# EAGLE design LEDSync_AR (EAGLE 8.3.2)
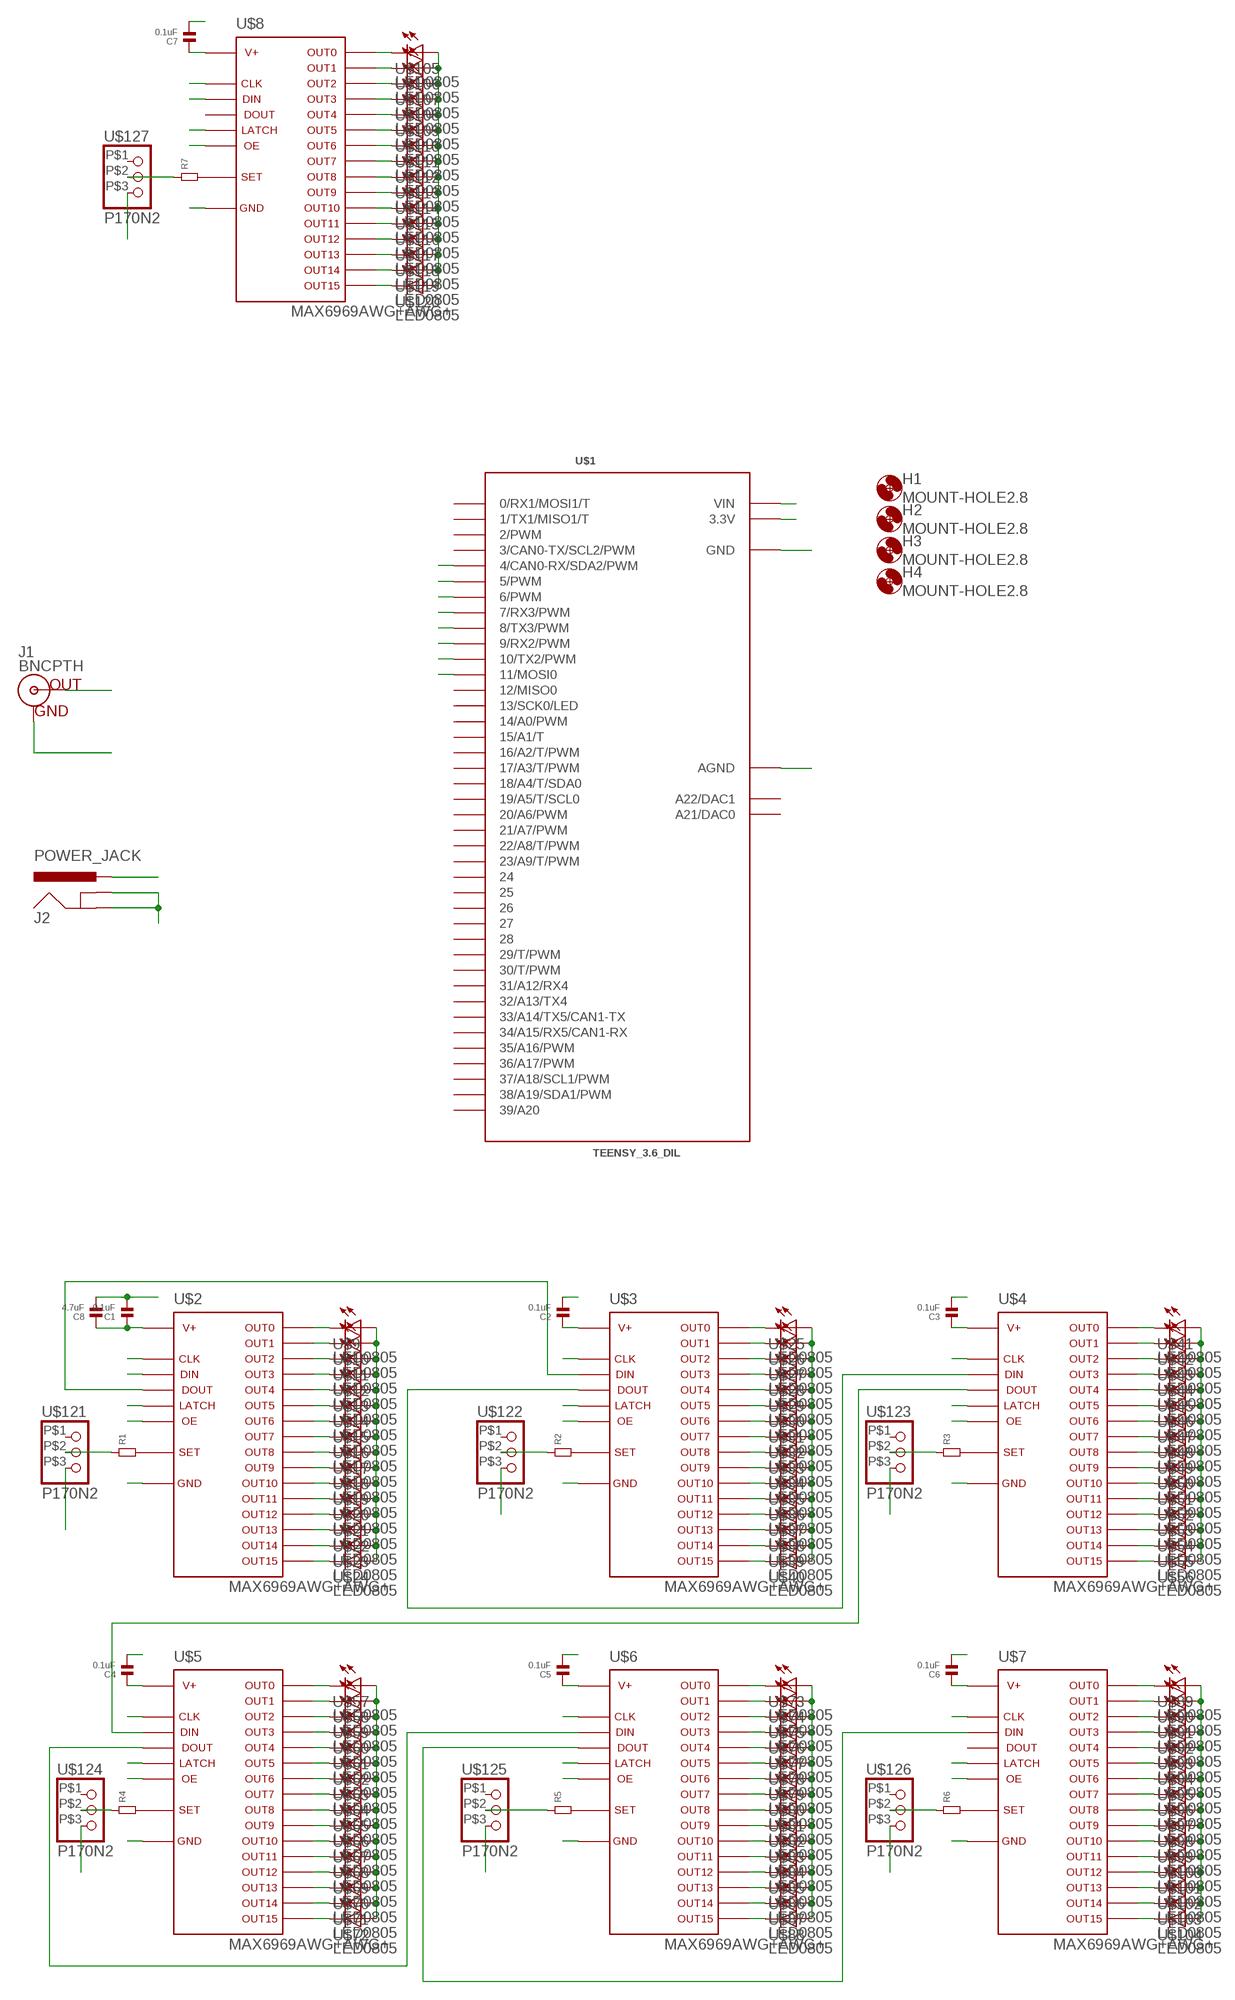
[diagram p0: schematic, sheet 1]

## Parts
C1  0.1uF  CAPACITOR.0805  [0805]
C2  0.1uF  CAPACITOR.0805  [0805]
C3  0.1uF  CAPACITOR.0805  [0805]
C4  0.1uF  CAPACITOR.0805  [0805]
C5  0.1uF  CAPACITOR.0805  [0805]
C6  0.1uF  CAPACITOR.0805  [0805]
C7  0.1uF  CAPACITOR.0805  [0805]
C8  4.7uF  CAPACITOR.0805  [0805]
H1  MOUNT-HOLE2.8  [2,8]
H2  MOUNT-HOLE2.8  [2,8]
H3  MOUNT-HOLE2.8  [2,8]
H4  MOUNT-HOLE2.8  [2,8]
J1  BNCPTH  [BNC]
J2  POWER_JACK  [POWER_JACK_PTH]
R1  RESISTOR.0805  [0805]
R2  RESISTOR.0805  [0805]
R3  RESISTOR.0805  [0805]
R4  RESISTOR.0805  [0805]
R5  RESISTOR.0805  [0805]
R6  RESISTOR.0805  [0805]
R7  RESISTOR.0805  [0805]
U$1  TEENSY_3.6_DIL  [TEENSY_3.6_DIL]
U$2  MAX6969AWG+AWG+  [SO24L]
U$3  MAX6969AWG+AWG+  [SO24L]
U$4  MAX6969AWG+AWG+  [SO24L]
U$5  MAX6969AWG+AWG+  [SO24L]
U$6  MAX6969AWG+AWG+  [SO24L]
U$7  MAX6969AWG+AWG+  [SO24L]
U$8  MAX6969AWG+AWG+  [SO24L]
U$9  LED0805  [0805]
U$10  LED0805  [0805]
U$11  LED0805  [0805]
U$12  LED0805  [0805]
U$13  LED0805  [0805]
U$14  LED0805  [0805]
U$15  LED0805  [0805]
U$16  LED0805  [0805]
U$17  LED0805  [0805]
U$18  LED0805  [0805]
U$19  LED0805  [0805]
U$20  LED0805  [0805]
U$21  LED0805  [0805]
U$22  LED0805  [0805]
U$23  LED0805  [0805]
U$24  LED0805  [0805]
U$25  LED0805  [0805]
U$26  LED0805  [0805]
U$27  LED0805  [0805]
U$28  LED0805  [0805]
U$29  LED0805  [0805]
U$30  LED0805  [0805]
U$31  LED0805  [0805]
U$32  LED0805  [0805]
U$33  LED0805  [0805]
U$34  LED0805  [0805]
U$35  LED0805  [0805]
U$36  LED0805  [0805]
U$37  LED0805  [0805]
U$38  LED0805  [0805]
U$39  LED0805  [0805]
U$40  LED0805  [0805]
U$41  LED0805  [0805]
U$42  LED0805  [0805]
U$43  LED0805  [0805]
U$44  LED0805  [0805]
U$45  LED0805  [0805]
U$46  LED0805  [0805]
U$47  LED0805  [0805]
U$48  LED0805  [0805]
U$49  LED0805  [0805]
U$50  LED0805  [0805]
U$51  LED0805  [0805]
U$52  LED0805  [0805]
U$53  LED0805  [0805]
U$54  LED0805  [0805]
U$55  LED0805  [0805]
U$56  LED0805  [0805]
U$57  LED0805  [0805]
U$58  LED0805  [0805]
U$59  LED0805  [0805]
U$60  LED0805  [0805]
U$61  LED0805  [0805]
U$62  LED0805  [0805]
U$63  LED0805  [0805]
U$64  LED0805  [0805]
U$65  LED0805  [0805]
U$66  LED0805  [0805]
U$67  LED0805  [0805]
U$68  LED0805  [0805]
U$69  LED0805  [0805]
U$70  LED0805  [0805]
U$71  LED0805  [0805]
U$72  LED0805  [0805]
U$73  LED0805  [0805]
U$74  LED0805  [0805]
U$75  LED0805  [0805]
U$76  LED0805  [0805]
U$77  LED0805  [0805]
U$78  LED0805  [0805]
U$79  LED0805  [0805]
U$80  LED0805  [0805]
U$81  LED0805  [0805]
U$82  LED0805  [0805]
U$83  LED0805  [0805]
U$84  LED0805  [0805]
U$85  LED0805  [0805]
U$86  LED0805  [0805]
U$87  LED0805  [0805]
U$88  LED0805  [0805]
U$89  LED0805  [0805]
U$90  LED0805  [0805]
U$91  LED0805  [0805]
U$92  LED0805  [0805]
U$93  LED0805  [0805]
U$94  LED0805  [0805]
U$95  LED0805  [0805]
U$96  LED0805  [0805]
U$97  LED0805  [0805]
U$98  LED0805  [0805]
U$99  LED0805  [0805]
U$100  LED0805  [0805]
U$101  LED0805  [0805]
U$102  LED0805  [0805]
U$103  LED0805  [0805]
U$104  LED0805  [0805]
U$105  LED0805  [0805]
U$106  LED0805  [0805]
U$107  LED0805  [0805]
U$108  LED0805  [0805]
U$109  LED0805  [0805]
U$110  LED0805  [0805]
U$111  LED0805  [0805]
U$112  LED0805  [0805]
U$113  LED0805  [0805]
U$114  LED0805  [0805]
U$115  LED0805  [0805]
U$116  LED0805  [0805]
U$117  LED0805  [0805]
U$118  LED0805  [0805]
U$119  LED0805  [0805]
U$120  LED0805  [0805]
U$121  P170N2  [P170N2]
U$122  P170N2  [P170N2]
U$123  P170N2  [P170N2]
U$124  P170N2  [P170N2]
U$125  P170N2  [P170N2]
U$126  P170N2  [P170N2]
U$127  P170N2  [P170N2]

## Nets
3V3: U$1.3.3V U$1.3.3V3(3.3V)
G_CLK: U$1.5(5/PWM) U$2.3 U$3.3 U$4.3 U$5.3 U$6.3 U$7.3
G_D: U$1.4(4/CAN0-RX/SDA2/PWM) U$2.2
G_LE: J1.S(OUT) U$1.6(6/PWM) U$2.4 U$3.4 U$4.4 U$5.4 U$6.4 U$7.4
G_OE: U$1.7(7/RX3/PWM) U$2.21 U$3.21 U$4.21 U$5.21 U$6.21 U$7.21
GND: C1.2 C2.2 C3.2 C4.2 C5.2 C6.2 C7.2 C8.2 J1.GND J2.GND J2.GNDBREAK U$1.AGND U$1.GND U$1.GND1(GND) U$2.1 U$3.1 U$4.1 U$5.1 U$6.1 U$7.1 U$8.1 U$121.P$3 U$122.P$3 U$123.P$3 U$124.P$3 U$125.P$3 U$126.P$3 U$127.P$3
N$1: U$2.5 U$9.2(C)
N$2: U$2.6 U$10.2(C)
N$3: U$2.7 U$11.2(C)
N$4: U$2.8 U$12.2(C)
N$5: U$2.9 U$13.2(C)
N$6: U$2.10 U$14.2(C)
N$7: U$2.11 U$15.2(C)
N$8: U$2.12 U$16.2(C)
N$9: U$2.13 U$17.2(C)
N$10: U$2.14 U$18.2(C)
N$11: U$2.15 U$19.2(C)
N$12: U$2.16 U$20.2(C)
N$13: U$2.17 U$21.2(C)
N$14: U$2.18 U$22.2(C)
N$15: U$2.19 U$23.2(C)
N$16: U$2.20 U$24.2(C)
N$17: U$3.5 U$25.2(C)
N$18: U$3.6 U$26.2(C)
N$19: U$3.7 U$27.2(C)
N$20: U$3.8 U$28.2(C)
N$21: U$3.9 U$29.2(C)
N$22: U$3.10 U$30.2(C)
N$23: U$3.11 U$31.2(C)
N$24: U$3.12 U$32.2(C)
N$25: U$3.13 U$33.2(C)
N$26: U$3.14 U$34.2(C)
N$27: U$3.15 U$35.2(C)
N$28: U$3.16 U$36.2(C)
N$29: U$3.17 U$37.2(C)
N$30: U$3.18 U$38.2(C)
N$31: U$3.19 U$39.2(C)
N$32: U$3.20 U$40.2(C)
N$33: U$4.5 U$41.2(C)
N$34: U$4.6 U$42.2(C)
N$35: U$4.7 U$43.2(C)
N$36: U$4.8 U$44.2(C)
N$37: U$4.9 U$45.2(C)
N$38: U$4.10 U$46.2(C)
N$39: U$4.11 U$47.2(C)
N$40: U$4.12 U$48.2(C)
N$41: U$4.13 U$49.2(C)
N$42: U$4.14 U$50.2(C)
N$43: U$4.15 U$51.2(C)
N$44: U$4.16 U$52.2(C)
N$45: U$4.17 U$53.2(C)
N$46: U$4.18 U$54.2(C)
N$47: U$4.19 U$55.2(C)
N$48: U$4.20 U$56.2(C)
N$49: U$5.5 U$57.2(C)
N$50: U$5.6 U$58.2(C)
N$51: U$5.7 U$59.2(C)
N$52: U$5.8 U$60.2(C)
N$53: U$5.9 U$61.2(C)
N$54: U$5.10 U$62.2(C)
N$55: U$5.11 U$63.2(C)
N$56: U$5.12 U$64.2(C)
N$57: U$5.13 U$65.2(C)
N$58: U$5.14 U$66.2(C)
N$59: U$5.15 U$67.2(C)
N$60: U$5.16 U$68.2(C)
N$61: U$5.17 U$69.2(C)
N$62: U$5.18 U$70.2(C)
N$63: U$5.19 U$71.2(C)
N$64: U$5.20 U$72.2(C)
N$65: U$6.5 U$73.2(C)
N$66: U$6.6 U$74.2(C)
N$67: U$6.7 U$75.2(C)
N$68: U$6.8 U$76.2(C)
N$69: U$6.9 U$77.2(C)
N$70: U$6.10 U$78.2(C)
N$71: U$6.11 U$79.2(C)
N$72: U$6.12 U$80.2(C)
N$73: U$6.13 U$81.2(C)
N$74: U$6.14 U$82.2(C)
N$75: U$6.15 U$83.2(C)
N$76: U$6.16 U$84.2(C)
N$77: U$6.17 U$85.2(C)
N$78: U$6.18 U$86.2(C)
N$79: U$6.19 U$87.2(C)
N$80: U$6.20 U$88.2(C)
N$81: U$7.5 U$89.2(C)
N$82: U$7.6 U$90.2(C)
N$83: U$7.7 U$91.2(C)
N$84: U$7.8 U$92.2(C)
N$85: U$7.9 U$93.2(C)
N$86: U$7.10 U$94.2(C)
N$87: U$7.11 U$95.2(C)
N$88: U$7.12 U$96.2(C)
N$89: U$7.13 U$97.2(C)
N$90: U$7.14 U$98.2(C)
N$91: U$7.16 U$100.2(C)
N$92: U$7.17 U$101.2(C)
N$93: U$7.18 U$102.2(C)
N$94: U$7.19 U$103.2(C)
N$95: U$7.20 U$104.2(C)
N$96: U$8.5 U$105.2(C)
N$97: U$8.6 U$106.2(C)
N$98: U$8.7 U$107.2(C)
N$99: U$8.8 U$108.2(C)
N$100: U$8.10 U$110.2(C)
N$101: U$8.11 U$111.2(C)
N$102: U$8.12 U$112.2(C)
N$103: U$8.13 U$113.2(C)
N$104: U$8.14 U$114.2(C)
N$105: U$8.15 U$115.2(C)
N$106: U$8.16 U$116.2(C)
N$107: U$8.17 U$117.2(C)
N$108: U$8.18 U$118.2(C)
N$109: U$8.19 U$119.2(C)
N$110: U$8.20 U$120.2(C)
N$111: U$8.9 U$109.2(C)
N$112: U$7.15 U$99.2(C)
N$116: R1.2 U$2.23
N$117: R2.2 U$3.23
N$118: R3.2 U$4.23
N$119: R4.2 U$5.23
N$120: R5.2 U$6.23
N$125: R6.2 U$7.23
N$126: R7.2 U$8.23
N$127: R7.1 U$127.P$2
N$128: U$2.22 U$3.2
N$130: R1.1 U$121.P$2
N$132: R2.1 U$122.P$2
N$134: R3.1 U$123.P$2
N$136: R6.1 U$126.P$2
N$138: R5.1 U$125.P$2
N$140: R4.1 U$124.P$2
N$146: U$3.22 U$4.2
N$147: U$4.22 U$5.2
N$148: U$5.22 U$6.2
N$149: U$6.22 U$7.2
T_CLK: U$1.9(9/RX2/PWM) U$8.3
T_D: U$1.8(8/TX3/PWM) U$8.2
T_LE: U$1.10(10/TX2/PWM) U$8.4
T_OE: U$1.11(11/MOSI0) U$8.21
VIN: C1.1 C2.1 C3.1 C4.1 C5.1 C6.1 C7.1 C8.1 J2.PWR U$1.VIN U$2.24 U$3.24 U$4.24 U$5.24 U$6.24 U$7.24 U$8.24 U$9.1(A) U$10.1(A) U$11.1(A) U$12.1(A) U$13.1(A) U$14.1(A) U$15.1(A) U$16.1(A) U$17.1(A) U$18.1(A) U$19.1(A) U$20.1(A) U$21.1(A) U$22.1(A) U$23.1(A) U$24.1(A) U$25.1(A) U$26.1(A) U$27.1(A) U$28.1(A) U$29.1(A) U$30.1(A) U$31.1(A) U$32.1(A) U$33.1(A) U$34.1(A) U$35.1(A) U$36.1(A) U$37.1(A) U$38.1(A) U$39.1(A) U$40.1(A) U$41.1(A) U$42.1(A) U$43.1(A) U$44.1(A) U$45.1(A) U$46.1(A) U$47.1(A) U$48.1(A) U$49.1(A) U$50.1(A) U$51.1(A) U$52.1(A) U$53.1(A) U$54.1(A) U$55.1(A) U$56.1(A) U$57.1(A) U$58.1(A) U$59.1(A) U$60.1(A) U$61.1(A) U$62.1(A) U$63.1(A) U$64.1(A) U$65.1(A) U$66.1(A) U$67.1(A) U$68.1(A) U$69.1(A) U$70.1(A) U$71.1(A) U$72.1(A) U$73.1(A) U$74.1(A) U$75.1(A) U$76.1(A) U$77.1(A) U$78.1(A) U$79.1(A) U$80.1(A) U$81.1(A) U$82.1(A) U$83.1(A) U$84.1(A) U$85.1(A) U$86.1(A) U$87.1(A) U$88.1(A) U$89.1(A) U$90.1(A) U$91.1(A) U$92.1(A) U$93.1(A) U$94.1(A) U$95.1(A) U$96.1(A) U$97.1(A) U$98.1(A) U$99.1(A) U$100.1(A) U$101.1(A) U$102.1(A) U$103.1(A) U$104.1(A) U$105.1(A) U$106.1(A) U$107.1(A) U$108.1(A) U$109.1(A) U$110.1(A) U$111.1(A) U$112.1(A) U$113.1(A) U$114.1(A) U$115.1(A) U$116.1(A) U$117.1(A) U$118.1(A) U$119.1(A) U$120.1(A)
Unconnected: U$1.0(0/RX1/MOSI1/T) U$1.1(1/TX1/MISO1/T) U$1.2(2/PWM) U$1.3(3/CAN0-TX/SCL2/PWM) U$1.12(12/MISO0) U$1.13(13/SCK0/LED) U$1.14/A0(14/A0/PWM) U$1.15/A1(15/A1/T) U$1.16/A2(16/A2/T/PWM) U$1.17/A3(17/A3/T/PWM) U$1.18/A4(18/A4/T/SDA0) U$1.19/A5(19/A5/T/SCL0) U$1.20/A6(20/A6/PWM) U$1.21/A7(21/A7/PWM) U$1.22/A8(22/A8/T/PWM) U$1.23/A9(23/A9/T/PWM) U$1.24 U$1.25 U$1.26 U$1.27 U$1.28 U$1.29(29/T/PWM) U$1.30(30/T/PWM) U$1.31/A12(31/A12/RX4) U$1.32/A13(32/A13/TX4) U$1.33/A14(33/A14/TX5/CAN1-TX) U$1.34/A15(34/A15/RX5/CAN1-RX) U$1.35/A16(35/A16/PWM) U$1.36/A17(36/A17/PWM) U$1.37/A18(37/A18/SCL1/PWM) U$1.38/A19(38/A19/SDA1/PWM) U$1.39/A20 U$1.A21(A21/DAC0) U$1.A22(A22/DAC1) U$7.22 U$8.22 U$121.P$1 U$122.P$1 U$123.P$1 U$124.P$1 U$125.P$1 U$126.P$1 U$127.P$1

## Library data of the parts
C1-C8 = standardparts:CAPACITOR
H1-H4 = holes:MOUNT-HOLE: MOUNTING HOLE with drill center marker
J1 = SparkFun-Connectors:BNC: BNC Right Angle Connector Mouser Part# 5227161 SparkFun Products: BNC Connector - Right Angle <https://www.sparkfun.com/products/10550>; PROD_ID: LPA-12729; SF_ID: PRT-10550
J2 = SparkFun-Connectors:POWER_JACK: Power Jack Connector This is the standard 5.5mm barrel jack for power. The PTH is the most common, proven, reliable, footprint. The Slot footprint only works if the mill layer is transmitted to the PCB fab house so be warned. Here are the connectors we sell at SparkFun: DC Barrel Power Jack/Connector <https://www.sparkfun.com/products/119> (PRT-00119) DC Barrel Power Jack/Connector (SMD) <https://www.sparkfun.com/products/12748> (PRT-12748) DC Barrel Jack Adapter - Breadboard Compatible <https://www.sparkfun.com/products/10811> (PRT-10811) It is used on this SparkFun product (and many, many others): SparkFun RedBoard - Programmed with Arduino <https://www.sparkfun.com/products/12757> (DEV-12757) Also, if you need a mating power supply or connector, please check these out: Wall Adapter Power Supply - 9VDC 650mA <https://www.sparkfun.com/products/298> (TOL-00298) DC Barrel Jack Adapter - Male <https://www.sparkfun.com/products/10287> (PRT-10287); PROD_ID: CONN-08197
R1-R7 = standardparts:RESISTOR
U$1 = radu-eagle-lib:TEENSY_3.6_DIL: Teensy 3.6 DIL Package
U$2-U$8 = radu-eagle-lib:MAX6969AWG+
U$9-U$120 = radu-eagle-lib:LED0805
U$121-U$127 = radu-eagle-lib:P170N2

## Board
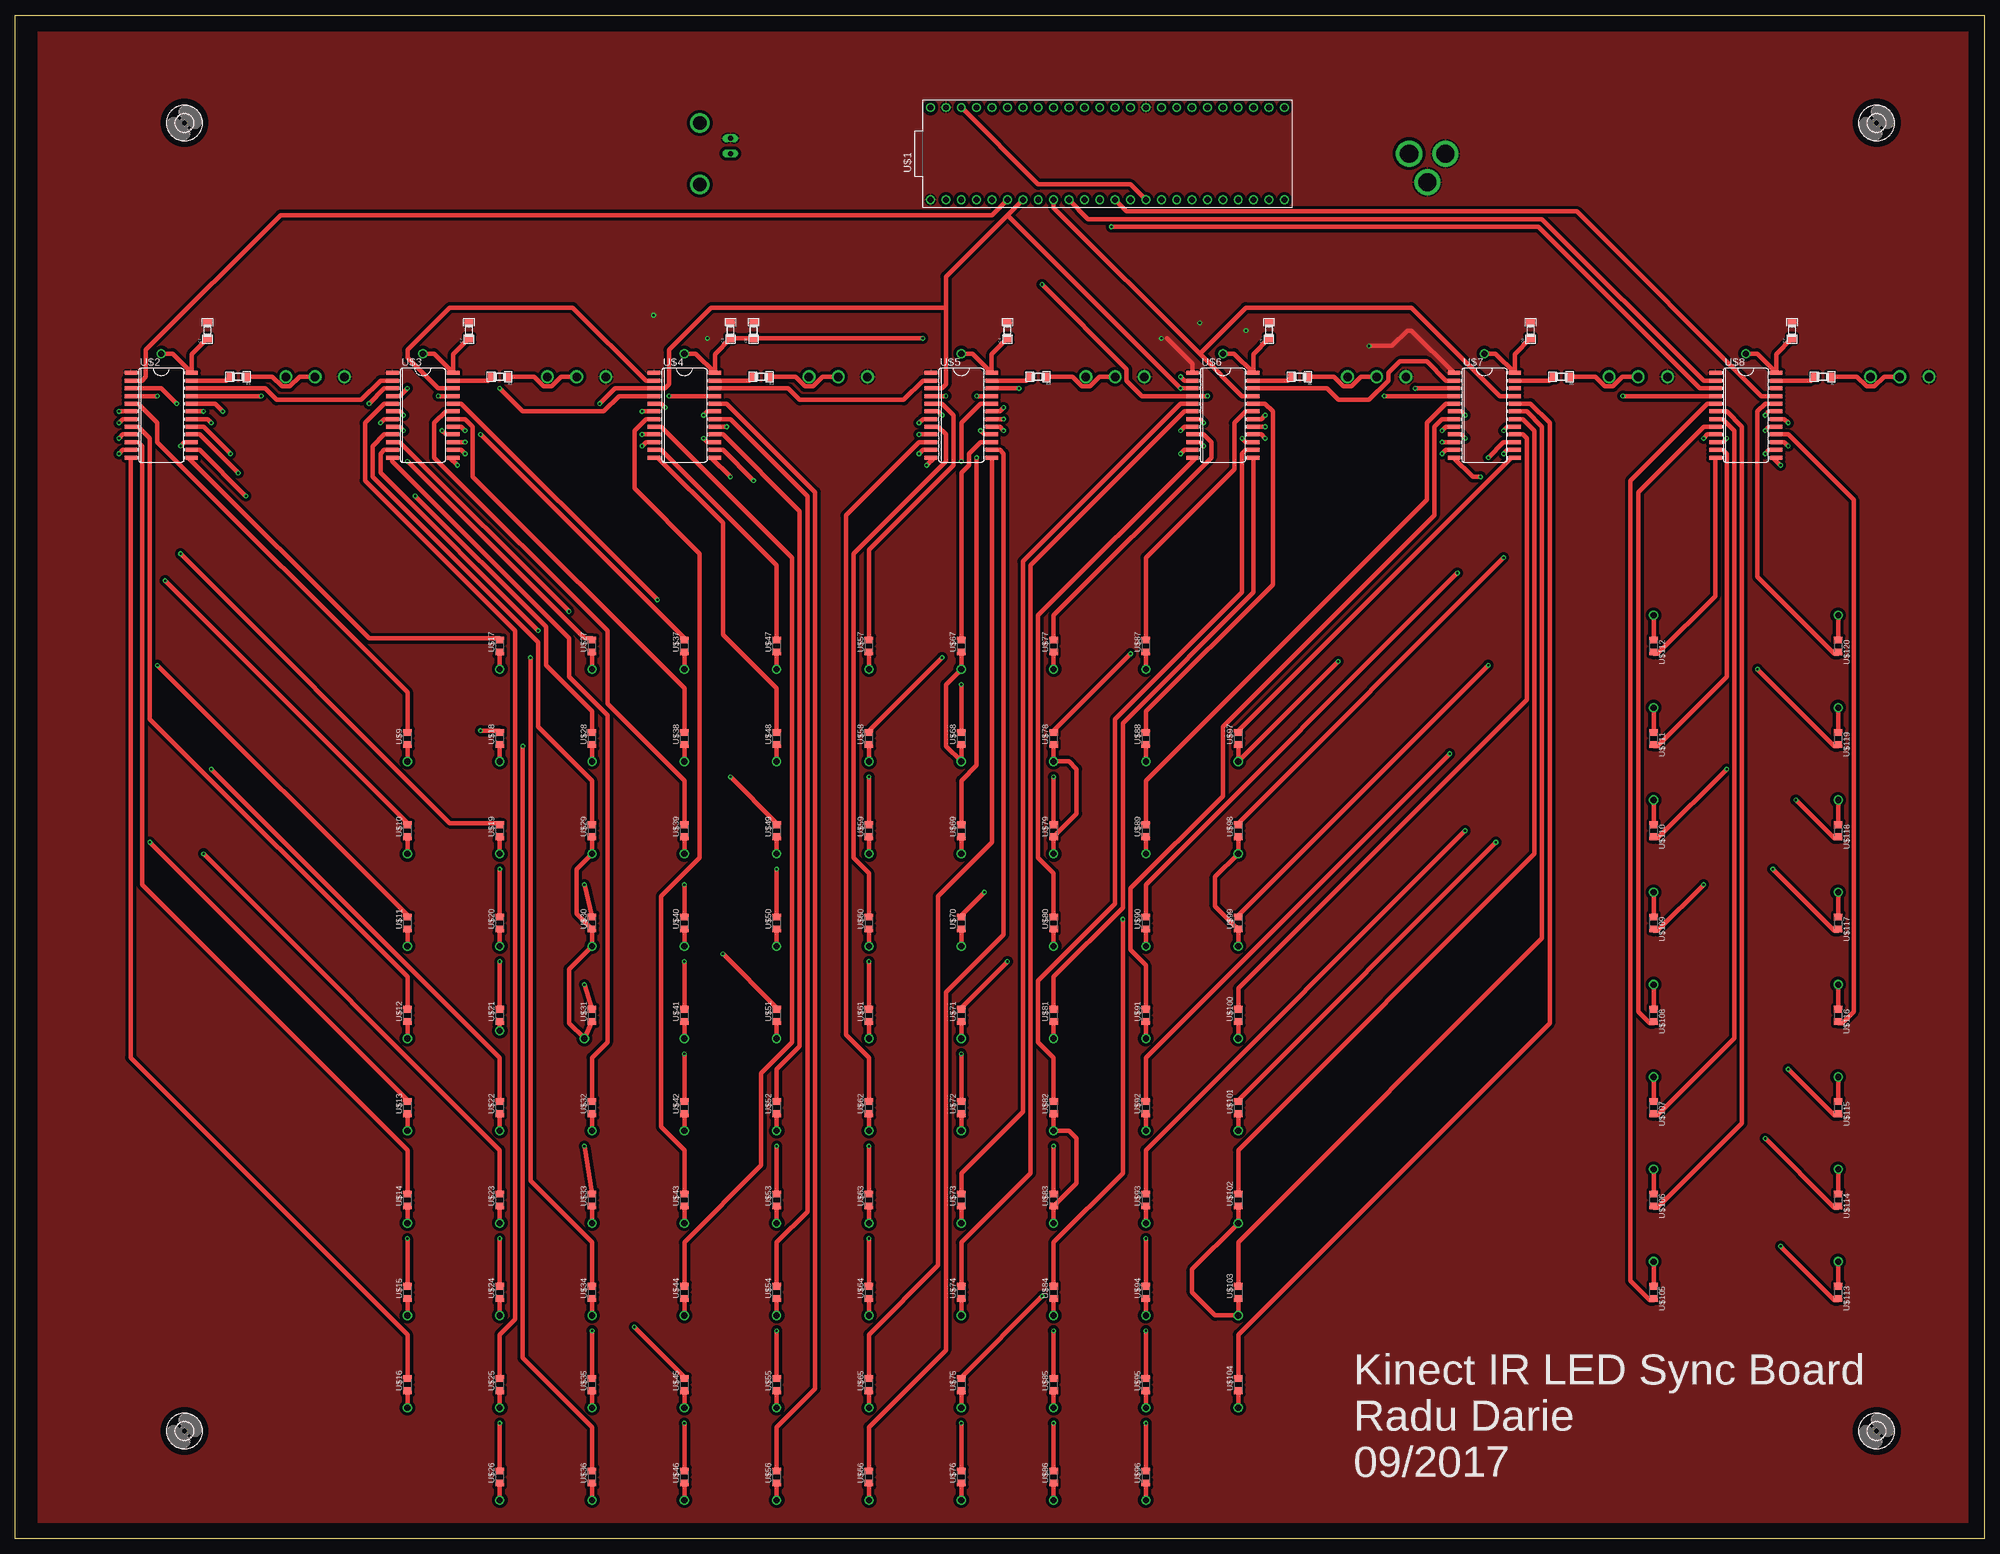
[diagram p1: board, top side]
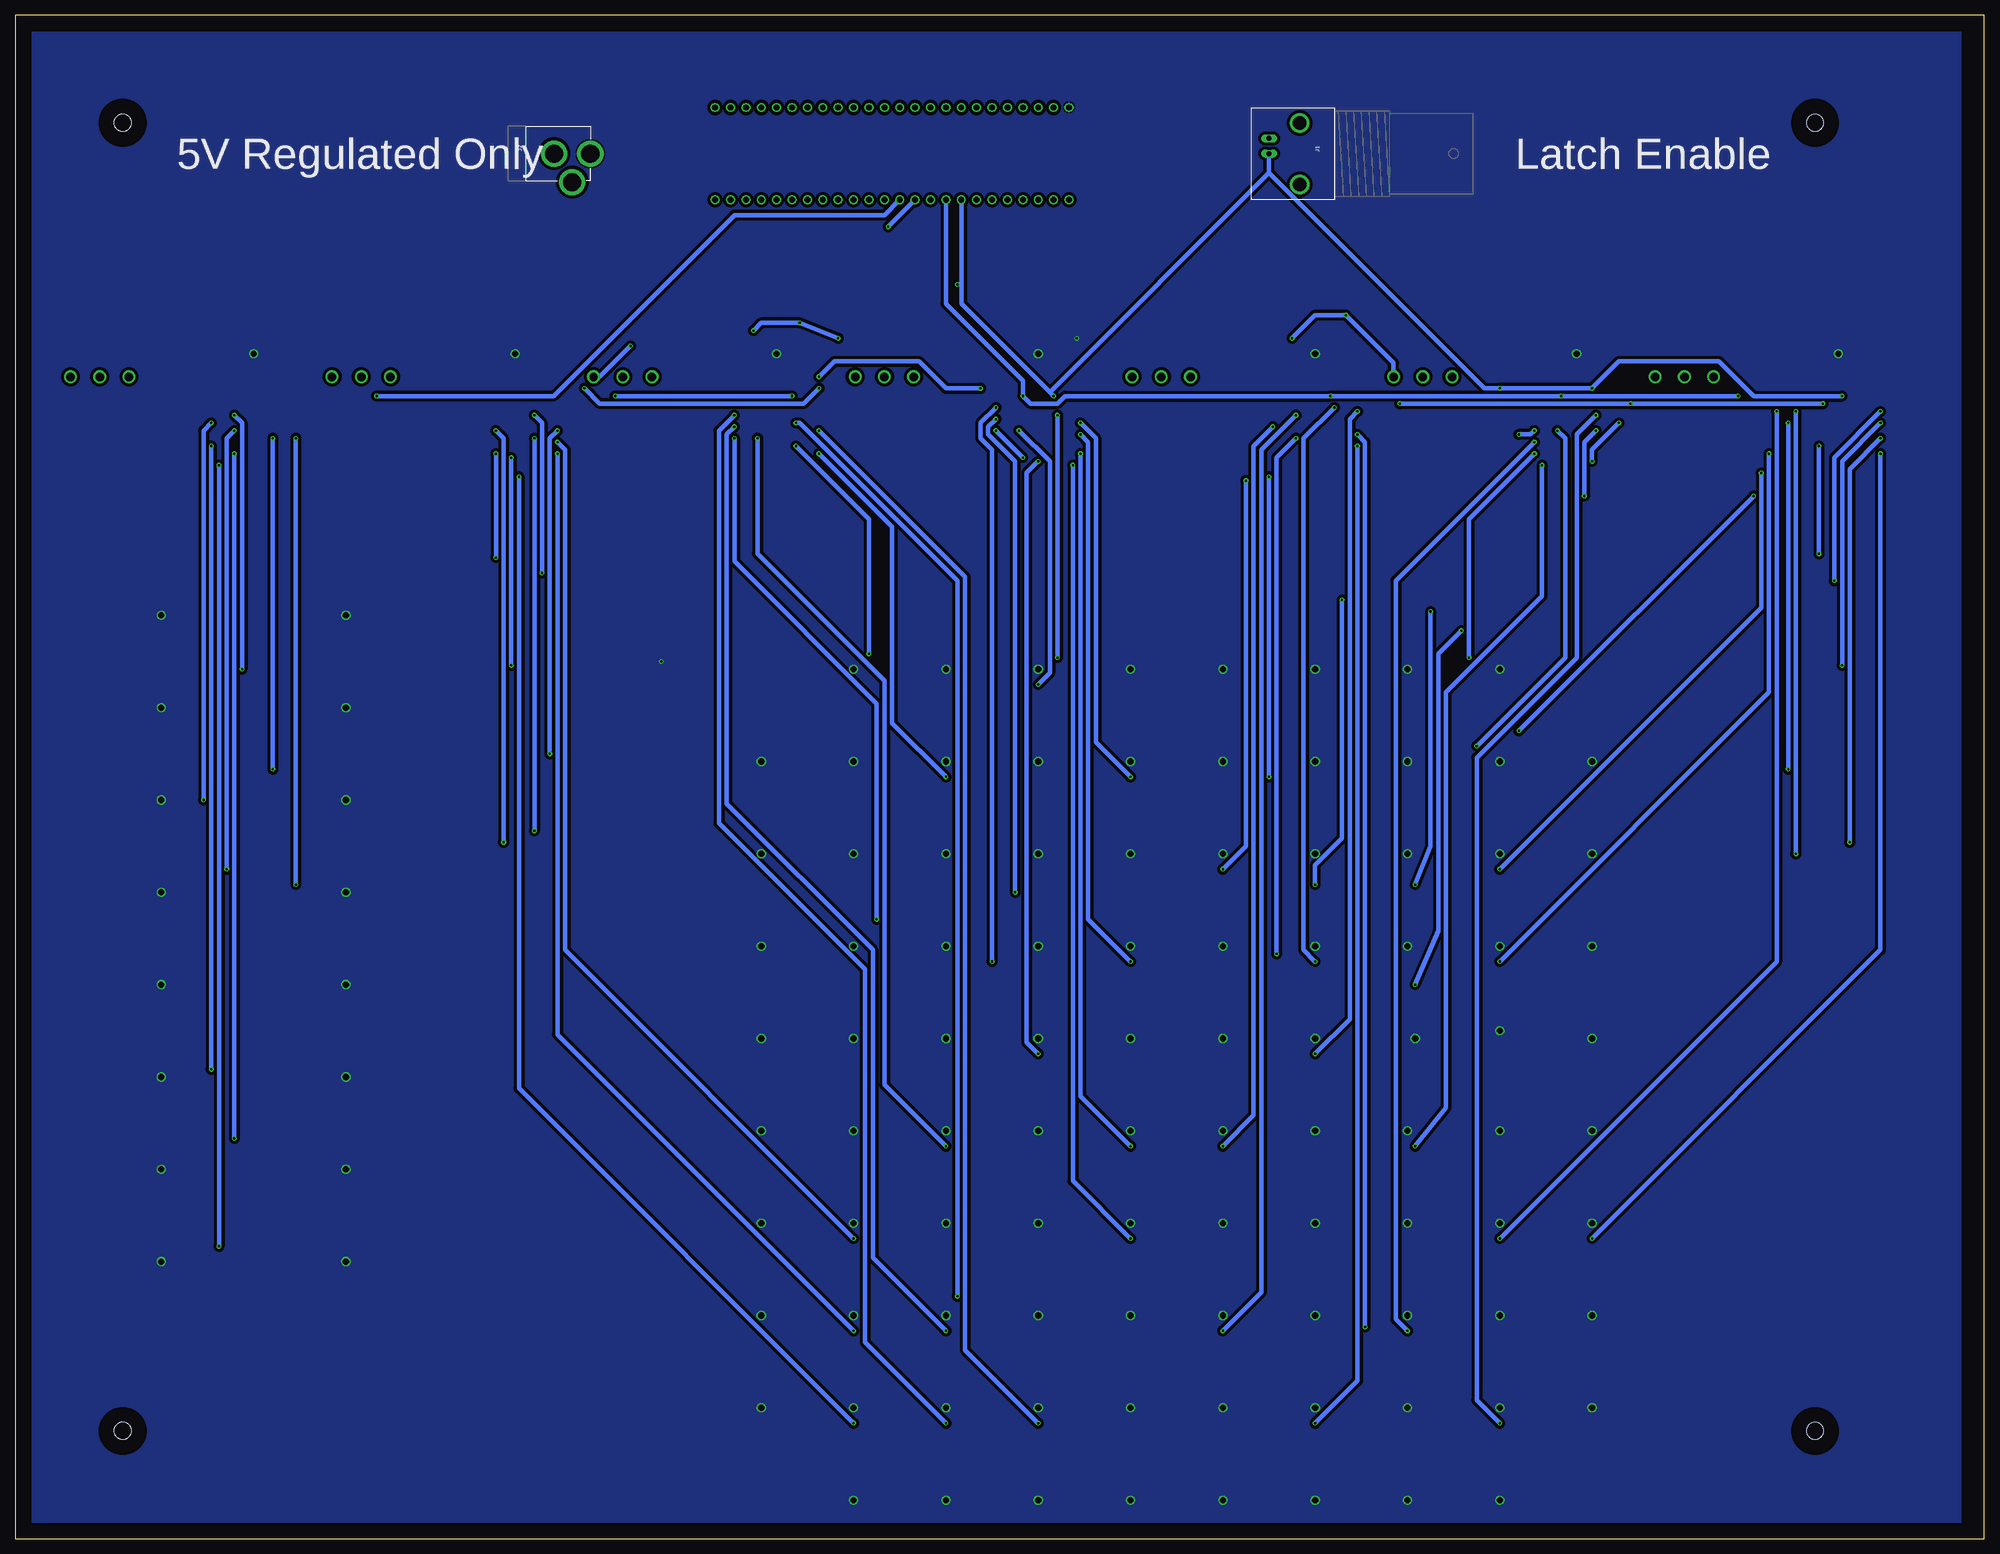
[diagram p2: board, bottom side, seen from below]

Size 325.12 x 251.46 mm. Coordinates in mm from the lower left corner, seen from the top.
Outline: 0,251.46 325.12,251.46 325.12,0 0,0 0,251.46
Copper layers (1*16): Top 0.035mm / dielectric 1.5mm / Bottom 0.035mm
Design rules "default *": minimum track width 20mil, minimum drill 0.35mm, track to track 20mil, track to pad 6mil, pad to pad 6mil, via to via 6mil, smd to smd 6mil, copper to edge 100mil, drill to drill 6mil, minimum pad ring 10mil, minimum via ring 8mil, stop-mask expansion 4mil, vias tented up to drill 0mil, thermal gap 10mil

### Footprints (pad centres in the part's own frame; a part is rotated, then mirrored left to right if it is on the bottom)
0805 = smd 1.2 x 1.4: 1 -1.3,0; 2 1.3,0
2,8 = hole 2.8: 0,0
BNC = drill 2.2: 3 -5.08,5.08; 4 5.08,5.08 | drill 0.8 long: GND -2.54,0; S 0,0
POWER_JACK_PTH = drill 2.997 pad 4.318: GND 0,7.7; GNDBREAK 4.7,10.7; PWR 0,13.7
TEENSY_3.6_DIL = drill 0.965: 0 -7.62,25.4; 1 -7.62,22.86; 2 -7.62,20.32; 3 -7.62,17.78; 3.3V 7.62,22.86; 3.3V3 -7.62,-7.62; 4 -7.62,15.24; 5 -7.62,12.7; 6 -7.62,10.16; 7 -7.62,7.62; 8 -7.62,5.08; 9 -7.62,2.54; 10 -7.62,0; 11 -7.62,-2.54; 12 -7.62,-5.08; 13 7.62,-5.08; 14/A0 7.62,-2.54; 15/A1 7.62,0; 16/A2 7.62,2.54; 17/A3 7.62,5.08; 18/A4 7.62,7.62; 19/A5 7.62,10.16; 20/A6 7.62,12.7; 21/A7 7.62,15.24; 22/A8 7.62,17.78; 23/A9 7.62,20.32; 24 -7.62,-10.16; 25 -7.62,-12.7; 26 -7.62,-15.24; 27 -7.62,-17.78; 28 -7.62,-20.32; 29 -7.62,-22.86; 30 -7.62,-25.4; 31/A12 -7.62,-27.94; 32/A13 -7.62,-30.48; 33/A14 7.62,-30.48; 34/A15 7.62,-27.94; 35/A16 7.62,-25.4; 36/A17 7.62,-22.86; 37/A18 7.62,-20.32; 38/A19 7.62,-17.78; 39/A20 7.62,-15.24; A21 7.62,-12.7; A22 7.62,-10.16; AGND 7.62,25.4; GND -7.62,27.94; GND1 7.62,-7.62; VIN 7.62,27.94
SO24L = smd 0.66 x 2.032: 1 -6.985,-5.029; 2 -5.715,-5.029; 3 -4.445,-5.029; 4 -3.175,-5.029; 5 -1.905,-5.029; 6 -0.635,-5.029; 7 0.635,-5.029; 8 1.905,-5.029; 9 3.175,-5.029; 10 4.445,-5.029; 11 5.715,-5.029; 12 6.985,-5.029; 13 6.985,5.029; 14 5.715,5.029; 15 4.445,5.029; 16 3.175,5.029; 17 1.905,5.029; 18 0.635,5.029; 19 -0.635,5.029; 20 -1.905,5.029; 21 -3.175,5.029; 22 -4.445,5.029; 23 -5.715,5.029; 24 -6.985,5.029
0805' = smd 1.1 x 1.4: 1 -1,0; 2 1,0
P170N2 = drill 1.397: P$1 4.826,0; P$2 0,0; P$3 -4.826,0

### Placement (x,y rotation side)
C1  31.75,199.39 90 top
C2  74.93,199.39 90 top
C3  118.11,199.39 90 top
C4  163.83,199.39 90 top
C5  207.01,199.39 90 top
C6  250.19,199.39 90 top
C7  293.37,199.39 90 top
C8  121.92,199.39 90 top
H1  27.94,233.68 0 top
H2  307.34,233.68 0 top
H3  307.34,17.78 0 top
H4  27.94,17.78 0 top
J1  118.11,228.6 270 bottom
J2  243.84,228.6 270 bottom
R1  36.83,191.77 180 top
R2  80.01,191.77 180 top
R3  123.19,191.77 180 top
R4  168.91,191.77 180 top
R5  212.09,191.77 180 top
R6  255.27,191.77 180 top
R7  298.45,191.77 180 top
U$1  179.07,228.6 90 top
U$2  24.13,185.42 270 top
U$3  67.31,185.42 270 top
U$4  110.49,185.42 270 top
U$5  156.21,185.42 270 top
U$6  199.39,185.42 270 top
U$7  242.57,185.42 270 top
U$8  285.75,185.42 270 top
U$9  LED0805  [0805']  64.77,132.08 90 top
U$10  LED0805  [0805']  64.77,116.84 90 top
U$11  LED0805  [0805']  64.77,101.6 90 top
U$12  LED0805  [0805']  64.77,86.36 90 top
U$13  LED0805  [0805']  64.77,71.12 90 top
U$14  LED0805  [0805']  64.77,55.88 90 top
U$15  LED0805  [0805']  64.77,40.64 90 top
U$16  LED0805  [0805']  64.77,25.4 90 top
U$17  LED0805  [0805']  80.01,147.32 90 top
U$18  LED0805  [0805']  80.01,132.08 90 top
U$19  LED0805  [0805']  80.01,116.84 90 top
U$20  LED0805  [0805']  80.01,101.6 90 top
U$21  LED0805  [0805']  80.01,86.36 90 top
U$22  LED0805  [0805']  80.01,71.12 90 top
U$23  LED0805  [0805']  80.01,55.88 90 top
U$24  LED0805  [0805']  80.01,40.64 90 top
U$25  LED0805  [0805']  80.01,25.4 90 top
U$26  LED0805  [0805']  80.01,10.16 90 top
U$27  LED0805  [0805']  95.25,147.32 90 top
U$28  LED0805  [0805']  95.25,132.08 90 top
U$29  LED0805  [0805']  95.25,116.84 90 top
U$30  LED0805  [0805']  95.25,101.6 90 top
U$31  LED0805  [0805']  95.25,86.36 90 top
U$32  LED0805  [0805']  95.25,71.12 90 top
U$33  LED0805  [0805']  95.25,55.88 90 top
U$34  LED0805  [0805']  95.25,40.64 90 top
U$35  LED0805  [0805']  95.25,25.4 90 top
U$36  LED0805  [0805']  95.25,10.16 90 top
U$37  LED0805  [0805']  110.49,147.32 90 top
U$38  LED0805  [0805']  110.49,132.08 90 top
U$39  LED0805  [0805']  110.49,116.84 90 top
U$40  LED0805  [0805']  110.49,101.6 90 top
U$41  LED0805  [0805']  110.49,86.36 90 top
U$42  LED0805  [0805']  110.49,71.12 90 top
U$43  LED0805  [0805']  110.49,55.88 90 top
U$44  LED0805  [0805']  110.49,40.64 90 top
U$45  LED0805  [0805']  110.49,25.4 90 top
U$46  LED0805  [0805']  110.49,10.16 90 top
U$47  LED0805  [0805']  125.73,147.32 90 top
U$48  LED0805  [0805']  125.73,132.08 90 top
U$49  LED0805  [0805']  125.73,116.84 90 top
U$50  LED0805  [0805']  125.73,101.6 90 top
U$51  LED0805  [0805']  125.73,86.36 90 top
U$52  LED0805  [0805']  125.73,71.12 90 top
U$53  LED0805  [0805']  125.73,55.88 90 top
U$54  LED0805  [0805']  125.73,40.64 90 top
U$55  LED0805  [0805']  125.73,25.4 90 top
U$56  LED0805  [0805']  125.73,10.16 90 top
U$57  LED0805  [0805']  140.97,147.32 90 top
U$58  LED0805  [0805']  140.97,132.08 90 top
U$59  LED0805  [0805']  140.97,116.84 90 top
U$60  LED0805  [0805']  140.97,101.6 90 top
U$61  LED0805  [0805']  140.97,86.36 90 top
U$62  LED0805  [0805']  140.97,71.12 90 top
U$63  LED0805  [0805']  140.97,55.88 90 top
U$64  LED0805  [0805']  140.97,40.64 90 top
U$65  LED0805  [0805']  140.97,25.4 90 top
U$66  LED0805  [0805']  140.97,10.16 90 top
U$67  LED0805  [0805']  156.21,147.32 90 top
U$68  LED0805  [0805']  156.21,132.08 90 top
U$69  LED0805  [0805']  156.21,116.84 90 top
U$70  LED0805  [0805']  156.21,101.6 90 top
U$71  LED0805  [0805']  156.21,86.36 90 top
U$72  LED0805  [0805']  156.21,71.12 90 top
U$73  LED0805  [0805']  156.21,55.88 90 top
U$74  LED0805  [0805']  156.21,40.64 90 top
U$75  LED0805  [0805']  156.21,25.4 90 top
U$76  LED0805  [0805']  156.21,10.16 90 top
U$77  LED0805  [0805']  171.45,147.32 90 top
U$78  LED0805  [0805']  171.45,132.08 90 top
U$79  LED0805  [0805']  171.45,116.84 90 top
U$80  LED0805  [0805']  171.45,101.6 90 top
U$81  LED0805  [0805']  171.45,86.36 90 top
U$82  LED0805  [0805']  171.45,71.12 90 top
U$83  LED0805  [0805']  171.45,55.88 90 top
U$84  LED0805  [0805']  171.45,40.64 90 top
U$85  LED0805  [0805']  171.45,25.4 90 top
U$86  LED0805  [0805']  171.45,10.16 90 top
U$87  LED0805  [0805']  186.69,147.32 90 top
U$88  LED0805  [0805']  186.69,132.08 90 top
U$89  LED0805  [0805']  186.69,116.84 90 top
U$90  LED0805  [0805']  186.69,101.6 90 top
U$91  LED0805  [0805']  186.69,86.36 90 top
U$92  LED0805  [0805']  186.69,71.12 90 top
U$93  LED0805  [0805']  186.69,55.88 90 top
U$94  LED0805  [0805']  186.69,40.64 90 top
U$95  LED0805  [0805']  186.69,25.4 90 top
U$96  LED0805  [0805']  186.69,10.16 90 top
U$97  LED0805  [0805']  201.93,132.08 90 top
U$98  LED0805  [0805']  201.93,116.84 90 top
U$99  LED0805  [0805']  201.93,101.6 90 top
U$100  LED0805  [0805']  201.93,86.36 90 top
U$101  LED0805  [0805']  201.93,71.12 90 top
U$102  LED0805  [0805']  201.93,55.88 90 top
U$103  LED0805  [0805']  201.93,40.64 90 top
U$104  LED0805  [0805']  201.93,25.4 90 top
U$105  LED0805  [0805']  270.51,40.64 270 top
U$106  LED0805  [0805']  270.51,55.88 270 top
U$107  LED0805  [0805']  270.51,71.12 270 top
U$108  LED0805  [0805']  270.51,86.36 270 top
U$109  LED0805  [0805']  270.51,101.6 270 top
U$110  LED0805  [0805']  270.51,116.84 270 top
U$111  LED0805  [0805']  270.51,132.08 270 top
U$112  LED0805  [0805']  270.51,147.32 270 top
U$113  LED0805  [0805']  300.99,40.64 270 top
U$114  LED0805  [0805']  300.99,55.88 270 top
U$115  LED0805  [0805']  300.99,71.12 270 top
U$116  LED0805  [0805']  300.99,86.36 270 top
U$117  LED0805  [0805']  300.99,101.6 270 top
U$118  LED0805  [0805']  300.99,116.84 270 top
U$119  LED0805  [0805']  300.99,132.08 270 top
U$120  LED0805  [0805']  300.99,147.32 270 top
U$121  49.53,191.77 180 top
U$122  92.71,191.77 180 top
U$123  135.89,191.77 180 top
U$124  181.61,191.77 180 top
U$125  224.79,191.77 180 top
U$126  267.97,191.77 180 top
U$127  311.15,191.77 180 top

### Tracks (layer width: path | path; a pad name or v marks a point on that pad's centre or on a via)
3V3
  Top 0.762: U$1.3.3V 168.91,223.52 184.15,223.52 U$1.3.3V3
G_CLK  (via drill 0.35)
  Top 0.762: U$2.3 24.13,189.87 v26.67,187.32 | v58.42,187.32 60.96,189.87 U$3.3 | v96.52,187.32 99.06,189.87 U$4.3 107.31,189.87 107.95,190.5 107.95,196.22 114.94,203.2 153.67,203.2 | U$5.3 153.03,189.87 153.67,190.5 153.67,203.2 | 153.67,203.2 153.67,208.28 163.83,218.44 | U$1.5 163.83,218.44 | U$6.3 v192.41,189.87 163.83,218.44 | v231.14,189.87 U$7.3
  Bottom 0.762: v26.67,187.32 v58.42,187.32 v96.52,187.32 | v231.14,189.87 228.6,187.32 194.94,187.32 v192.41,189.87
G_D
  Top 0.762: U$2.2 20.95,191.13 21.59,191.77 21.59,196.22 43.81,218.44 161.29,218.44 U$1.4
G_LE  (via drill 0.35)
  Top 0.762: v23.49,188.59 U$2.4 | v64.77,189.87 63.5,188.59 U$3.4 | U$4.4 99.69,188.59 97.16,186.06 83.82,186.06 v80.01,189.87 | v153.67,188.59 U$5.4 | v169.54,207.01 183.51,193.04 183.51,191.13 186.06,188.59 U$6.4 v196.85,188.59 | v226.06,188.59 U$7.4
  Bottom 0.762: v23.49,188.59 38.1,188.59 43.81,194.31 60.32,194.31 v64.77,189.87 v80.01,189.87 82.55,189.87 118.11,225.43 | 154.31,189.23 168.91,203.84 168.91,207.01 | 154.31,189.23 v153.67,188.59 | U$1.6 168.91,207.01 | 168.91,207.01 v169.54,207.01 | v196.85,188.59 v226.06,188.59 | 118.11,225.43 J1.S | 154.31,189.23 118.11,225.43
G_OE  (via drill 0.35)
  Top 0.762: v40.64,188.59 U$2.21 | U$3.21 v69.85,188.59 | v107.95,188.59 U$4.21 | v158.75,188.59 U$5.21 | U$6.21 202.56,188.59 195.58,195.58 | 195.58,195.58 171.45,219.71 U$1.7 | U$7.21 245.11,188.59 230.5,203.2 203.2,203.2 195.58,195.58
  Bottom 0.762: v40.64,188.59 v69.85,188.59 v107.95,188.59 151.76,188.59 153.03,187.32 157.48,187.32 v158.75,188.59 158.75,191.13 171.45,203.84 U$1.7
GND  (via drill 0.35)
  Top 0.762: v223.52,196.85 227.33,196.85 229.87,199.39 230.56,199.39 U$7.1 | U$6.1 194.36,193.9 190.14,198.12
  Bottom 0.762: U$122.P$3 97.54,194.06 v105.41,201.93 110.49,201.93 v114.3,198.12 | U$125.P$3 228.6,191.77 v223.52,196.85 | v189.23,198.12 v195.58,200.66 201.93,200.66 v203.2,199.39
  pour Top: 3.81,248.92 322.58,248.92 322.58,2.54 3.81,2.54
N$1
  Top 0.762: U$9.2 64.77,139.7 23.49,180.97 23.49,184.15 20.32,187.32 U$2.5
N$2  (via drill 0.35)
  Top 0.762: v24.77,158.12 64.77,118.11 U$10.2 | U$2.6 v17.14,186.06
  Bottom 0.762: v24.77,158.12 24.77,178.44 v17.14,186.06
N$3  (via drill 0.35)
  Top 0.762: v23.49,144.14 64.77,102.87 U$11.2 | v17.14,184.15 17.78,184.78 U$2.7
  Bottom 0.762: v23.49,144.14 23.49,177.8 v17.14,184.15
N$4
  Top 0.762: U$12.2 64.77,92.71 22.22,135.25 22.22,181.61 20.32,183.51 U$2.8
N$5  (via drill 0.35)
  Top 0.762: v22.22,114.94 64.77,72.39 U$13.2 | v17.14,181.61 17.78,182.25 U$2.9
  Bottom 0.762: v22.22,114.94 22.22,176.53 v17.14,181.61
N$6
  Top 0.762: U$14.2 64.77,64.13 20.95,107.95 20.95,180.34 20.32,180.97 U$2.10
N$7  (via drill 0.35)
  Top 0.762: v64.77,49.53 U$15.2 | v17.14,179.07 17.78,179.7 U$2.11
  Bottom 0.762: v64.77,49.53 17.14,97.16 v17.14,179.07
N$8
  Top 0.762: U$16.2 64.77,33.66 19.05,79.38 19.05,178.44 U$2.12
N$9
  Top 0.762: U$17.2 80.01,148.59 58.42,148.59 28.57,178.44 U$2.13
N$10  (via drill 0.35)
  Top 0.762: v76.83,133.35 80.01,133.35 U$18.2 | v38.1,172.08 30.48,179.7 U$2.14
  Bottom 0.762: v38.1,172.08 v76.83,133.35
N$11  (via drill 0.35)
  Top 0.762: v27.3,162.56 71.75,118.11 80.01,118.11 U$19.2 | v27.3,180.34 27.94,180.97 U$2.15
  Bottom 0.762: v27.3,180.34 v27.3,162.56
N$12  (via drill 0.35)
  Top 0.762: v80.01,110.49 U$20.2 | v36.83,175.89 30.48,182.25 U$2.16
  Bottom 0.762: v80.01,110.49 36.83,153.67 v36.83,175.89
N$13  (via drill 0.35)
  Top 0.762: v80.01,95.25 U$21.2 | v35.56,179.07 31.11,183.51 U$2.17
  Bottom 0.762: v80.01,95.25 35.56,139.7 v35.56,179.07
N$14  (via drill 0.35)
  Top 0.762: U$22.2 80.01,79.38 v32.38,127 | v32.38,184.15 31.75,184.78 U$2.18
  Bottom 0.762: v32.38,184.15 v32.38,127
N$15  (via drill 0.35)
  Top 0.762: U$23.2 80.01,64.13 v31.11,113.03 | U$2.19 v31.11,186.06
  Bottom 0.762: v31.11,186.06 v31.11,113.03
N$16  (via drill 0.35)
  Top 0.762: v80.01,49.53 U$24.2 | v34.29,186.06 33.02,187.32 U$2.20
  Bottom 0.762: v80.01,49.53 34.29,95.25 v34.29,186.06
N$17
  Top 0.762: U$25.2 80.01,33.66 82.55,36.19 82.55,149.86 57.78,174.62 57.78,184.15 60.96,187.32 U$3.5
N$18  (via drill 0.35)
  Top 0.762: v80.01,19.05 U$26.2 | v64.13,185.42 63.5,186.06 U$3.6
  Bottom 0.762: v80.01,19.05 83.82,22.86 83.82,128.91 67.31,145.41 67.31,182.25 v64.13,185.42
N$19  (via drill 0.35)
  Top 0.762: v64.77,177.8 93.98,148.59 95.25,148.59 U$27.2 | v60.32,184.15 60.96,184.78 U$3.7
  Bottom 0.762: v64.77,177.8 64.77,179.7 v60.32,184.15
N$20  (via drill 0.35)
  Top 0.762: U$28.2 95.25,136.53 87.63,144.14 87.63,150.5 v66.04,172.08 | v64.13,182.88 63.5,183.51 U$3.8
  Bottom 0.762: v66.04,172.08 66.04,180.97 v64.13,182.88
N$21
  Top 0.762: U$29.2 95.25,125.09 86.36,133.99 86.36,147.95 59.05,175.26 59.05,180.34 60.96,182.25 U$3.9
N$22  (via drill 0.35)
  Top 0.762: v93.98,107.95 U$30.2 | v91.44,153.03 63.5,180.97 U$3.10
  Bottom 0.762: v93.98,107.95 91.44,114.3 v91.44,153.03
N$23  (via drill 0.35)
  Top 0.762: v93.98,91.44 U$31.2 | v86.36,149.86 60.32,175.89 60.32,179.07 60.96,179.7 U$3.11
  Bottom 0.762: v93.98,91.44 90.17,100.33 90.17,146.05 v86.36,149.86
N$24
  Top 0.762: U$32.2 95.25,79.38 97.79,81.91 97.79,135.89 91.44,142.24 91.44,148.59 62.23,177.8 62.23,178.44 U$3.12
N$25  (via drill 0.35)
  Top 0.762: v93.98,64.77 U$33.2 | v73.02,177.16 71.75,178.44 U$3.13
  Bottom 0.762: v93.98,64.77 88.9,71.12 88.9,139.7 73.02,155.57 v73.02,177.16
N$26  (via drill 0.35)
  Top 0.762: U$34.2 95.25,48.9 85.09,59.06 v85.09,145.41 | v74.29,179.07 73.66,179.7 U$3.14
  Bottom 0.762: v85.09,145.41 85.09,168.28 v74.29,179.07
N$27  (via drill 0.35)
  Top 0.762: v95.25,34.29 U$35.2 | U$3.15 v74.29,180.97
  Bottom 0.762: v95.25,34.29 97.16,36.19 97.16,158.12 v74.29,180.97
N$28  (via drill 0.35)
  Top 0.762: U$36.2 95.25,18.41 83.82,29.84 v83.82,130.81 | v70.48,182.88 71.12,182.25 U$3.16
  Bottom 0.762: v83.82,130.81 69.21,145.41 69.21,181.61 v70.48,182.88
N$29  (via drill 0.35)
  Top 0.762: v76.83,182.25 110.49,148.59 U$37.2 | v74.29,182.88 73.66,183.51 U$3.17
  Bottom 0.762: v76.83,182.25 74.93,182.25 v74.29,182.88
N$30
  Top 0.762: U$38.2 110.49,140.33 75.56,175.26 75.56,183.51 74.29,184.78 U$3.18
N$31
  Top 0.762: U$39.2 110.49,125.09 97.79,137.8 97.79,149.86 69.21,178.44 69.21,184.15 71.12,186.06 U$3.19
N$32  (via drill 0.35)
  Top 0.762: v110.49,107.95 U$40.2 | v106.04,154.94 73.66,187.32 U$3.20
  Bottom 0.762: v110.49,107.95 110.49,111.12 106.04,115.57 v106.04,154.94
N$33  (via drill 0.35)
  Top 0.762: v110.49,95.25 U$41.2 | v107.31,186.69 106.68,187.32 U$4.5
  Bottom 0.762: v110.49,95.25 112.39,97.16 112.39,181.61 v107.31,186.69
N$34  (via drill 0.35)
  Top 0.762: v110.49,80.01 U$42.2 | U$4.6 v103.5,186.06
  Bottom 0.762: v110.49,80.01 104.77,85.72 104.77,184.78 v103.5,186.06
N$35
  Top 0.762: U$43.2 110.49,64.13 106.68,67.94 106.68,106.04 113.03,112.39 113.03,162.56 102.23,173.35 102.23,182.88 104.14,184.78 U$4.7
N$36
  Top 0.762: U$44.2 110.49,48.9 123.19,61.59 123.19,76.84 128.27,81.91 128.27,161.93 106.68,183.51 U$4.8
N$37  (via drill 0.35)
  Top 0.762: v102.23,34.93 110.49,26.67 U$45.2 | U$4.9 v103.5,182.25
  Bottom 0.762: v102.23,34.93 102.23,180.97 v103.5,182.25
N$38  (via drill 0.35)
  Top 0.762: v110.49,19.05 U$46.2 | v103.5,180.34 104.14,180.97 U$4.10
  Bottom 0.762: v110.49,19.05 103.5,26.03 v103.5,180.34
N$39
  Top 0.762: U$47.2 125.73,160.66 106.68,179.7 U$4.11
N$40
  Top 0.762: U$48.2 125.73,140.33 116.84,149.22 116.84,167.64 106.04,178.44 U$4.12
N$41  (via drill 0.35)
  Top 0.762: v118.11,125.73 125.73,118.11 U$49.2 | v118.11,175.26 114.94,178.44 U$4.13
  Bottom 0.762: v118.11,175.26 v118.11,125.73
N$42  (via drill 0.35)
  Top 0.762: v125.73,110.49 U$50.2 | v121.92,174.62 116.84,179.7 U$4.14
  Bottom 0.762: v125.73,110.49 121.92,114.3 v121.92,174.62
N$43  (via drill 0.35)
  Top 0.762: v116.84,96.52 125.73,87.63 U$51.2 | v113.66,181.61 114.3,180.97 U$4.15
  Bottom 0.762: v116.84,96.52 116.84,178.44 v113.66,181.61
N$44
  Top 0.762: U$52.2 125.73,77.47 129.54,81.28 129.54,169.55 116.84,182.25 U$4.16
N$45  (via drill 0.35)
  Top 0.762: v125.73,64.77 U$53.2 | U$4.17 v117.47,183.51
  Bottom 0.762: v125.73,64.77 120.65,69.85 120.65,180.34 v117.47,183.51
N$46
  Top 0.762: U$54.2 125.73,48.9 130.81,53.97 130.81,172.08 118.11,184.78 U$4.18
N$47  (via drill 0.35)
  Top 0.762: v125.73,34.29 U$55.2 | v113.66,185.42 114.3,186.06 U$4.19
  Bottom 0.762: v125.73,34.29 119.38,40.64 119.38,179.7 v113.66,185.42
N$48
  Top 0.762: U$56.2 125.73,18.41 132.08,24.76 132.08,172.72 117.47,187.32 U$4.20
N$49
  Top 0.762: U$57.2 140.97,163.19 154.94,177.16 154.94,185.42 153.03,187.32 U$5.5
N$50  (via drill 0.35)
  Top 0.762: v153.03,145.41 140.97,133.35 U$58.2 | v153.03,185.42 152.4,186.06 U$5.6
  Bottom 0.762: v153.03,185.42 v153.03,145.41
N$51  (via drill 0.35)
  Top 0.762: v140.97,125.73 U$59.2 | v149.22,184.15 149.86,184.78 U$5.7
  Bottom 0.762: v140.97,125.73 146.69,131.44 146.69,181.61 v149.22,184.15
N$52
  Top 0.762: U$60.2 140.97,109.86 138.43,112.39 138.43,162.56 153.67,177.8 153.67,182.25 152.4,183.51 U$5.8
N$53  (via drill 0.35)
  Top 0.762: v140.97,95.25 U$61.2 | U$5.9 v149.22,182.25
  Bottom 0.762: v140.97,95.25 147.95,102.23 147.95,180.97 v149.22,182.25
N$54
  Top 0.762: U$62.2 140.97,79.38 137.16,83.19 137.16,168.91 149.22,180.97 U$5.10
N$55  (via drill 0.35)
  Top 0.762: v140.97,64.77 U$63.2 | v149.22,179.07 149.86,179.7 U$5.11
  Bottom 0.762: v140.97,64.77 149.22,73.03 v149.22,179.07
N$56  (via drill 0.35)
  Top 0.762: v140.97,49.53 U$64.2 | v150.5,177.16 151.76,178.44 U$5.12
  Bottom 0.762: v140.97,49.53 150.5,59.06 v150.5,177.16
N$57
  Top 0.762: U$65.2 140.97,33.66 152.4,45.09 152.4,106.04 161.29,114.94 161.29,178.44 U$5.13
N$58
  Top 0.762: U$66.2 140.97,18.41 153.67,31.12 153.67,90.17 163.19,99.69 163.19,179.07 162.56,179.7 U$5.14
N$59
  Top 0.762: U$67.2 156.21,175.89 157.48,177.16 157.48,179.07 159.38,180.97 U$5.15
N$60  (via drill 0.35)
  Top 0.762: v156.21,140.97 U$68.2 | v159.38,182.88 160.02,182.25 U$5.16
  Bottom 0.762: v156.21,140.97 154.31,142.88 154.31,177.8 v159.38,182.88
N$61  (via drill 0.35)
  Top 0.762: U$69.2 156.21,125.09 158.75,127.64 v158.75,178.44 | v163.19,182.88 162.56,183.51 U$5.17
  Bottom 0.762: v163.19,182.88 v158.75,178.44
N$62  (via drill 0.35)
  Top 0.762: v160.02,106.68 156.21,102.87 U$70.2 | U$5.18 v163.19,184.78
  Bottom 0.762: v160.02,106.68 160.02,177.8 164.47,182.25 164.47,183.51 v163.19,184.78
N$63  (via drill 0.35)
  Top 0.762: v163.83,95.25 156.21,87.63 U$71.2 | v163.19,186.69 162.56,186.06 U$5.19
  Bottom 0.762: v163.83,95.25 163.83,179.7 165.73,181.61 165.73,184.15 v163.19,186.69
N$64  (via drill 0.35)
  Top 0.762: v156.21,80.01 U$72.2 | v156.21,177.8 156.21,184.15 159.38,187.32 U$5.20
  Bottom 0.762: v156.21,80.01 158.12,81.91 158.12,175.89 v156.21,177.8
N$65
  Top 0.762: U$73.2 156.21,60.32 166.37,70.48 166.37,161.29 192.41,187.32 U$6.5
N$66
  Top 0.762: U$74.2 156.21,48.9 167.64,60.32 167.64,160.66 193.04,186.06 U$6.6
N$67  (via drill 0.35)
  Top 0.762: v169.54,40 156.21,26.67 U$75.2 | v196.22,184.15 195.58,184.78 U$6.7
  Bottom 0.762: v169.54,40 169.54,158.12 195.58,184.15 v196.22,184.15
N$68  (via drill 0.35)
  Top 0.762: v156.21,19.05 U$76.2 | v192.41,182.88 193.04,183.51 U$6.8
  Bottom 0.762: v156.21,19.05 168.27,31.12 168.27,158.75 v192.41,182.88
N$69
  Top 0.762: U$77.2 171.45,152.4 197.49,178.44 197.49,180.97 196.22,182.25 U$6.9
N$70  (via drill 0.35)
  Top 0.762: v184.15,146.05 171.45,133.35 U$78.2 | v196.22,180.34 195.58,180.97 U$6.10
  Bottom 0.762: v184.15,146.05 184.15,168.28 v196.22,180.34
N$71  (via drill 0.35)
  Top 0.762: v171.45,125.73 U$79.2 | v192.41,179.07 193.04,179.7 U$6.11
  Bottom 0.762: v171.45,125.73 180.34,134.62 180.34,167 v192.41,179.07
N$72
  Top 0.762: U$80.2 171.45,109.86 168.91,112.39 168.91,152.4 194.94,178.44 U$6.12
N$73
  Top 0.762: U$81.2 171.45,92.71 182.88,104.14 182.88,134.62 204.47,156.21 204.47,178.44 U$6.13
N$74
  Top 0.762: U$82.2 171.45,79.38 168.91,81.91 168.91,92.07 181.61,104.78 181.61,135.25 202.56,156.21 202.56,179.07 203.2,179.7 U$6.14
N$75  (via drill 0.35)
  Top 0.762: v171.45,64.77 U$83.2 | v202.56,181.61 203.2,180.97 U$6.15
  Bottom 0.762: v171.45,64.77 181.61,74.93 181.61,141.61 202.56,162.56 v202.56,181.61
N$76  (via drill 0.35)
  Top 0.762: U$84.2 171.45,48.9 182.88,60.32 v182.88,102.23 | v206.38,181.61 205.74,182.25 U$6.16
  Bottom 0.762: v182.88,102.23 182.88,137.8 206.38,161.29 v206.38,181.61
N$77  (via drill 0.35)
  Top 0.762: v171.45,34.29 U$85.2 | U$6.17 v206.38,183.51
  Bottom 0.762: v171.45,34.29 183.51,46.35 183.51,97.16 207.64,121.28 207.64,182.25 v206.38,183.51
N$78  (via drill 0.35)
  Top 0.762: v171.45,19.05 U$86.2 | v206.38,185.42 205.74,184.78 U$6.18
  Bottom 0.762: v171.45,19.05 184.78,32.38 184.78,93.98 208.91,118.11 208.91,182.88 v206.38,185.42
N$79
  Top 0.762: U$87.2 186.69,161.93 201.29,176.53 201.29,184.15 203.2,186.06 U$6.19
N$80
  Top 0.762: U$88.2 186.69,136.53 207.64,157.48 207.64,186.06 206.38,187.32 U$6.20
N$81
  Top 0.762: U$89.2 186.69,125.09 233.04,171.45 233.04,184.15 236.22,187.32 U$7.5
N$82  (via drill 0.35)
  Top 0.762: U$90.2 186.69,107.95 v238.12,159.38 | v239.39,185.42 238.76,186.06 U$7.6
  Bottom 0.762: v238.12,159.38 238.12,184.15 v239.39,185.42
N$83
  Top 0.762: U$91.2 186.69,94.62 184.15,97.16 184.15,107.31 199.39,122.55 199.39,133.99 234.31,168.91 234.31,183.51 235.58,184.78 U$7.7
N$84  (via drill 0.35)
  Top 0.762: U$92.2 186.69,79.38 v236.85,129.54 | v235.58,182.88 236.22,183.51 U$7.8
  Bottom 0.762: v236.85,129.54 236.85,181.61 v235.58,182.88
N$85  (via drill 0.35)
  Top 0.762: U$93.2 186.69,64.13 v239.39,116.84 | v239.39,181.61 238.76,182.25 U$7.9
  Bottom 0.762: v239.39,181.61 v239.39,116.84
N$86  (via drill 0.35)
  Top 0.762: v186.69,49.53 U$94.2 | U$7.10 v235.58,180.97
  Bottom 0.762: v186.69,49.53 234.31,97.16 234.31,179.7 v235.58,180.97
N$87  (via drill 0.35)
  Top 0.762: v186.69,34.29 U$95.2 | v235.58,179.07 236.22,179.7 U$7.11
  Bottom 0.762: v186.69,34.29 235.58,83.19 v235.58,179.07
N$88  (via drill 0.35)
  Top 0.762: v186.69,19.05 U$96.2 | v241.94,175.26 240.66,175.26 237.49,178.44 U$7.12
  Bottom 0.762: v186.69,19.05 241.94,74.29 v241.94,175.26
N$89
  Top 0.762: U$97.2 201.93,133.35 247.01,178.44 U$7.13
N$90  (via drill 0.35)
  Top 0.762: v245.75,161.93 201.93,118.11 U$98.2 | v245.75,179.07 246.38,179.7 U$7.14
  Bottom 0.762: v245.75,179.07 v245.75,161.93
N$91
  Top 0.762: U$100.2 201.93,90.81 249.56,138.43 249.56,181.61 248.92,182.25 U$7.16
N$92  (via drill 0.35)
  Top 0.762: v244.47,114.94 201.93,72.39 U$101.2 | v245.75,182.88 246.38,183.51 U$7.17
  Bottom 0.762: v244.47,114.94 244.47,181.61 v245.75,182.88
N$93
  Top 0.762: U$102.2 201.93,64.13 250.82,113.03 250.82,182.88 248.92,184.78 U$7.18
N$94
  Top 0.762: U$103.2 201.93,48.9 252.09,99.06 252.09,183.51 249.56,186.06 U$7.19
N$95
  Top 0.762: U$104.2 201.93,33.66 253.37,85.09 253.37,184.15 250.19,187.32 U$7.20
N$96
  Top 0.762: U$8.5 279.4,187.32 266.7,174.62 266.7,42.54 269.88,39.37 270.51,39.37 U$105.2
N$97
  Top 0.762: U$8.6 282.57,186.06 285.12,183.51 285.12,68.58 271.14,54.61 270.51,54.61 U$106.2
N$98
  Top 0.762: U$8.7 281.94,184.78 283.85,182.88 283.85,82.55 271.14,69.85 270.51,69.85 U$107.2
N$99
  Top 0.762: U$8.8 278.76,183.51 267.97,172.72 267.97,87 269.88,85.09 270.51,85.09 U$108.2
N$100  (via drill 0.35)
  Top 0.762: v282.57,127 271.14,115.57 270.51,115.57 U$110.2 | v282.57,181.61 281.94,180.97 U$8.10
  Bottom 0.762: v282.57,181.61 v282.57,127
N$101
  Top 0.762: U$8.11 281.94,179.7 282.57,179.07 282.57,142.24 271.14,130.81 270.51,130.81 U$111.2
N$102
  Top 0.762: U$112.2 270.51,146.05 271.14,146.05 280.67,155.57 280.67,178.44 U$8.12
N$103  (via drill 0.35)
  Top 0.762: v291.47,48.26 300.36,39.37 300.99,39.37 U$113.2 | v291.47,177.16 290.19,178.44 U$8.13
  Bottom 0.762: v291.47,177.16 v291.47,48.26
N$104  (via drill 0.35)
  Top 0.762: v288.92,66.04 300.36,54.61 300.99,54.61 U$114.2 | v288.92,179.07 289.56,179.7 U$8.14
  Bottom 0.762: v288.92,179.07 v288.92,66.04
N$105  (via drill 0.35)
  Top 0.762: v292.74,77.47 300.36,69.85 300.99,69.85 U$115.2 | v292.74,180.34 292.1,180.97 U$8.15
  Bottom 0.762: v292.74,180.34 v292.74,77.47
N$106
  Top 0.762: U$8.16 292.74,182.25 303.53,171.45 303.53,87 301.62,85.09 300.99,85.09 U$116.2
N$107  (via drill 0.35)
  Top 0.762: v290.19,110.49 300.36,100.33 300.99,100.33 U$117.2 | v288.92,182.88 289.56,183.51 U$8.17
  Bottom 0.762: v290.19,110.49 290.19,181.61 v288.92,182.88
N$108  (via drill 0.35)
  Top 0.762: v294,121.92 300.36,115.57 300.99,115.57 U$118.2 | v292.74,184.15 292.1,184.78 U$8.18
  Bottom 0.762: v294,121.92 294,182.88 v292.74,184.15
N$109  (via drill 0.35)
  Top 0.762: v287.65,143.51 300.36,130.81 300.99,130.81 U$119.2 | v288.92,185.42 289.56,186.06 U$8.19
  Bottom 0.762: v287.65,143.51 287.65,184.15 v288.92,185.42
N$110
  Top 0.762: U$8.20 288.92,187.32 287.65,186.06 287.65,158.75 300.36,146.05 300.99,146.05 U$120.2
N$111  (via drill 0.35)
  Top 0.762: v278.76,107.95 271.14,100.33 270.51,100.33 U$109.2 | v278.76,181.61 279.4,182.25 U$8.9
  Bottom 0.762: v278.76,181.61 v278.76,107.95
N$112  (via drill 0.35)
  Top 0.762: v243.2,144.14 201.93,102.87 U$99.2 | v243.2,178.44 245.75,180.97 U$7.15
  Bottom 0.762: v243.2,178.44 v243.2,144.14
N$116
  Top 0.762: U$2.23 34.89,191.13 R1.2
N$117
  Top 0.762: U$3.23 78.07,191.13 R2.2
N$118
  Top 0.762: U$4.23 121.25,191.13 R3.2
N$119
  Top 0.762: U$5.23 166.97,191.13 R4.2
N$120
  Top 0.762: U$6.23 210.16,191.13 R5.2
N$125
  Top 0.762: U$7.23 253.33,191.13 R6.2
N$126
  Top 0.762: U$8.23 296.51,191.13 R7.2
N$127
  Top 0.762: R7.1 304.09,191.77 305.67,190.19 306.98,190.19 308.56,191.77 U$127.P$2
N$128
  Top 0.762: U$2.22 41.27,189.87 43.18,187.96 57.15,187.96 60.32,191.13 U$3.2
N$130
  Top 0.762: R1.1 42.47,191.77 44.05,190.19 45.36,190.19 46.94,191.77 U$121.P$2
N$132
  Top 0.762: R2.1 85.65,191.77 87.23,190.19 88.54,190.19 90.12,191.77 U$122.P$2
N$134
  Top 0.762: R3.1 128.83,191.77 130.41,190.19 131.72,190.19 133.3,191.77 U$123.P$2
N$136
  Top 0.762: R6.1 260.91,191.77 262.49,190.19 263.8,190.19 265.38,191.77 U$126.P$2
N$138
  Top 0.762: R5.1 217.73,191.77 219.31,190.19 220.62,190.19 222.2,191.77 U$125.P$2
N$140
  Top 0.762: R4.1 174.55,191.77 176.13,190.19 177.44,190.19 179.02,191.77 U$124.P$2
N$146
  Top 0.762: U$3.22 69.85,189.87 64.77,194.94 64.77,196.22 71.75,203.2 92.07,203.2 104.14,191.13 U$4.2
N$147
  Top 0.762: U$4.22 127.63,189.87 129.54,187.96 146.69,187.96 149.86,191.13 U$5.2
N$148  (via drill 0.35)
  Top 0.762: v165.73,189.87 U$5.22 | v192.41,191.77 193.04,191.13 U$6.2
  Bottom 0.762: v165.73,189.87 171.45,189.87 175.89,194.31 189.87,194.31 v192.41,191.77
N$149
  Top 0.762: U$6.22 216.53,189.87 218.44,187.96 223.52,187.96 226.69,191.13 226.69,192.41 228.6,194.31 233.04,194.31 236.22,191.13 U$7.2
T_CLK  (via drill 0.35)
  Top 0.762: U$8.3 278.13,189.87 251.46,216.53 v180.97,216.53
  Bottom 0.762: U$1.9 v180.97,216.53
T_D
  Top 0.762: U$8.2 278.76,191.13 252.09,217.81 177.16,217.81 U$1.8
T_LE  (via drill 0.35)
  Top 0.762: v265.43,188.59 U$8.4
  Bottom 0.762: v265.43,188.59 236.22,188.59 206.38,218.44 181.61,218.44 U$1.10
T_OE
  Top 0.762: U$8.21 288.29,188.59 257.81,219.07 183.51,219.07 U$1.11
VIN  (via drill 0.35, 1.02 pad 1.3)
  Top 0.762: v64.77,128.27 U$9.1 | U$18.1 v80.01,128.27 | U$17.1 v80.01,143.51 | v95.25,143.51 U$27.1 | U$37.1 v110.49,143.51 | U$47.1 v125.73,143.51 | U$48.1 v125.73,128.27 | U$38.1 v110.49,128.27 | U$28.1 v95.25,128.27 | U$10.1 v64.77,113.03 | v80.01,113.03 U$19.1 | U$29.1 v95.25,113.03 92.71,110.49 92.71,103.14 94.33,101.52 U$30.1 v95.25,97.79 91.44,93.98 91.44,85.09 v93.98,82.55 U$31.1 | U$39.1 v110.49,113.03 | v125.73,113.03 U$49.1 | U$59.1 v140.97,113.03 | v140.97,128.27 U$58.1 | v140.97,143.51 U$57.1 | U$67.1 v156.21,143.51 153.67,140.97 153.67,130.81 v156.21,128.27 U$68.1 | U$77.1 v171.45,143.51 | v186.69,143.51 U$87.1 | U$97.1 v201.93,128.27 v218.44,144.78 | v186.69,128.27 U$88.1 | U$78.1 v171.45,128.27 173.99,128.27 175.26,127 175.26,119.65 172.37,116.76 U$79.1 v171.45,113.03 | U$98.1 v201.93,113.03 198.12,109.22 198.12,104.41 201.01,101.52 U$99.1 v201.93,97.79 | v186.69,113.03 U$89.1 | v156.21,113.03 U$69.1 | v186.69,97.79 U$90.1 | v171.45,97.79 U$80.1 | v156.21,97.79 U$70.1 | v140.97,97.79 U$60.1 | v125.73,97.79 U$50.1 | v110.49,97.79 U$40.1 | v64.77,97.79 U$11.1 | v80.01,97.79 U$20.1 | v64.77,82.55 U$12.1 | v64.77,67.31 U$13.1 | v64.77,52.07 U$14.1 | v80.01,52.07 U$23.1 | v80.01,67.31 U$22.1 | v80.01,83.82 U$21.1 | v95.25,67.31 U$32.1 | v95.25,52.07 U$33.1 | v110.49,52.07 U$43.1 | v110.49,67.31 U$42.1 | v110.49,82.55 U$41.1 | v125.73,82.55 U$51.1 | v140.97,82.55 U$61.1 | v156.21,82.55 U$71.1 | v171.45,82.55 U$81.1 | U$82.1 v171.45,67.31 173.99,67.31 175.26,66.04 175.26,58.69 172.37,55.8 U$83.1 v171.45,52.07 | v156.21,52.07 U$73.1 | v140.97,52.07 U$63.1 | v125.73,52.07 U$53.1 | v186.69,82.55 U$91.1 | v201.93,82.55 U$100.1 | v201.93,67.31 U$101.1
  Top 0.762: v186.69,67.31 U$92.1 | U$102.1 v201.93,52.07 194.31,44.45 194.31,40.64 198.12,36.83 v201.93,36.83 U$103.1 | v186.69,52.07 U$93.1 | v201.93,21.59 U$104.1 | v186.69,36.83 U$94.1 | v186.69,21.59 U$95.1 | v186.69,6.35 U$96.1 | v171.45,6.35 U$86.1 | v171.45,21.59 U$85.1 | v171.45,36.83 U$84.1 | v156.21,36.83 U$74.1 | v156.21,21.59 U$75.1 | v156.21,6.35 U$76.1 | v140.97,6.35 U$66.1 | v140.97,21.59 U$65.1 | v140.97,36.83 U$64.1 | v125.73,36.83 U$54.1 | v125.73,21.59 U$55.1 | v125.73,6.35 U$56.1 | v110.49,6.35 U$46.1 | v110.49,21.59 U$45.1 | v110.49,36.83 U$44.1 | v95.25,36.83 U$34.1 | v95.25,21.59 U$35.1 | v95.25,6.35 U$36.1 | v80.01,6.35 U$26.1 | v80.01,21.59 U$25.1 | v64.77,21.59 U$16.1 | v64.77,36.83 U$15.1 | v80.01,36.83 U$24.1 | v125.73,67.31 U$52.1 | v140.97,67.31 U$62.1 | v156.21,67.31 U$72.1 | U$105.1 v270.51,45.72 | U$106.1 v270.51,60.96 | U$107.1 v270.51,76.2 | U$108.1 v270.51,91.44 | U$109.1 v270.51,106.68 | U$110.1 v270.51,121.92 | U$111.1 v270.51,137.16 | U$112.1 v270.51,152.4 | U$120.1 v300.99,152.4 | U$119.1 v300.99,137.16 | v300.99,121.92 U$118.1 | v300.99,106.68 U$117.1 | v300.99,91.44 U$116.1 | v300.99,76.2 U$115.1 | v300.99,60.96 U$114.1 | v300.99,45.72 U$113.1 | v285.75,195.58 287.6,195.58 U$8.24 290.78,195.5 C7.1 | v242.57,195.58 244.42,195.58 U$7.24 247.6,195.5 C6.1 | v199.39,195.58 201.24,195.58 U$6.24 204.42,195.5 C5.1 | v156.21,195.58 158.06,195.58 U$5.24 161.24,195.5 C4.1 | v110.49,195.58 112.34,195.58 U$4.24 115.52,195.5 C3.1 C8.1 149.83,198.09 v149.86,198.12 | v67.31,195.58 69.16,195.58 U$3.24 72.34,195.5 C2.1 | v24.13,195.58 25.98,195.58 U$2.24 29.16,195.5 C1.1
  pour Bottom: 3.81,248.92 322.58,248.92 322.58,2.54 3.81,2.54

### Text on the board
tPlace: Kinect IR LED Sync Board | Radu Darie | 09/2017
bPlace: Latch Enable | 5V Regulated Only